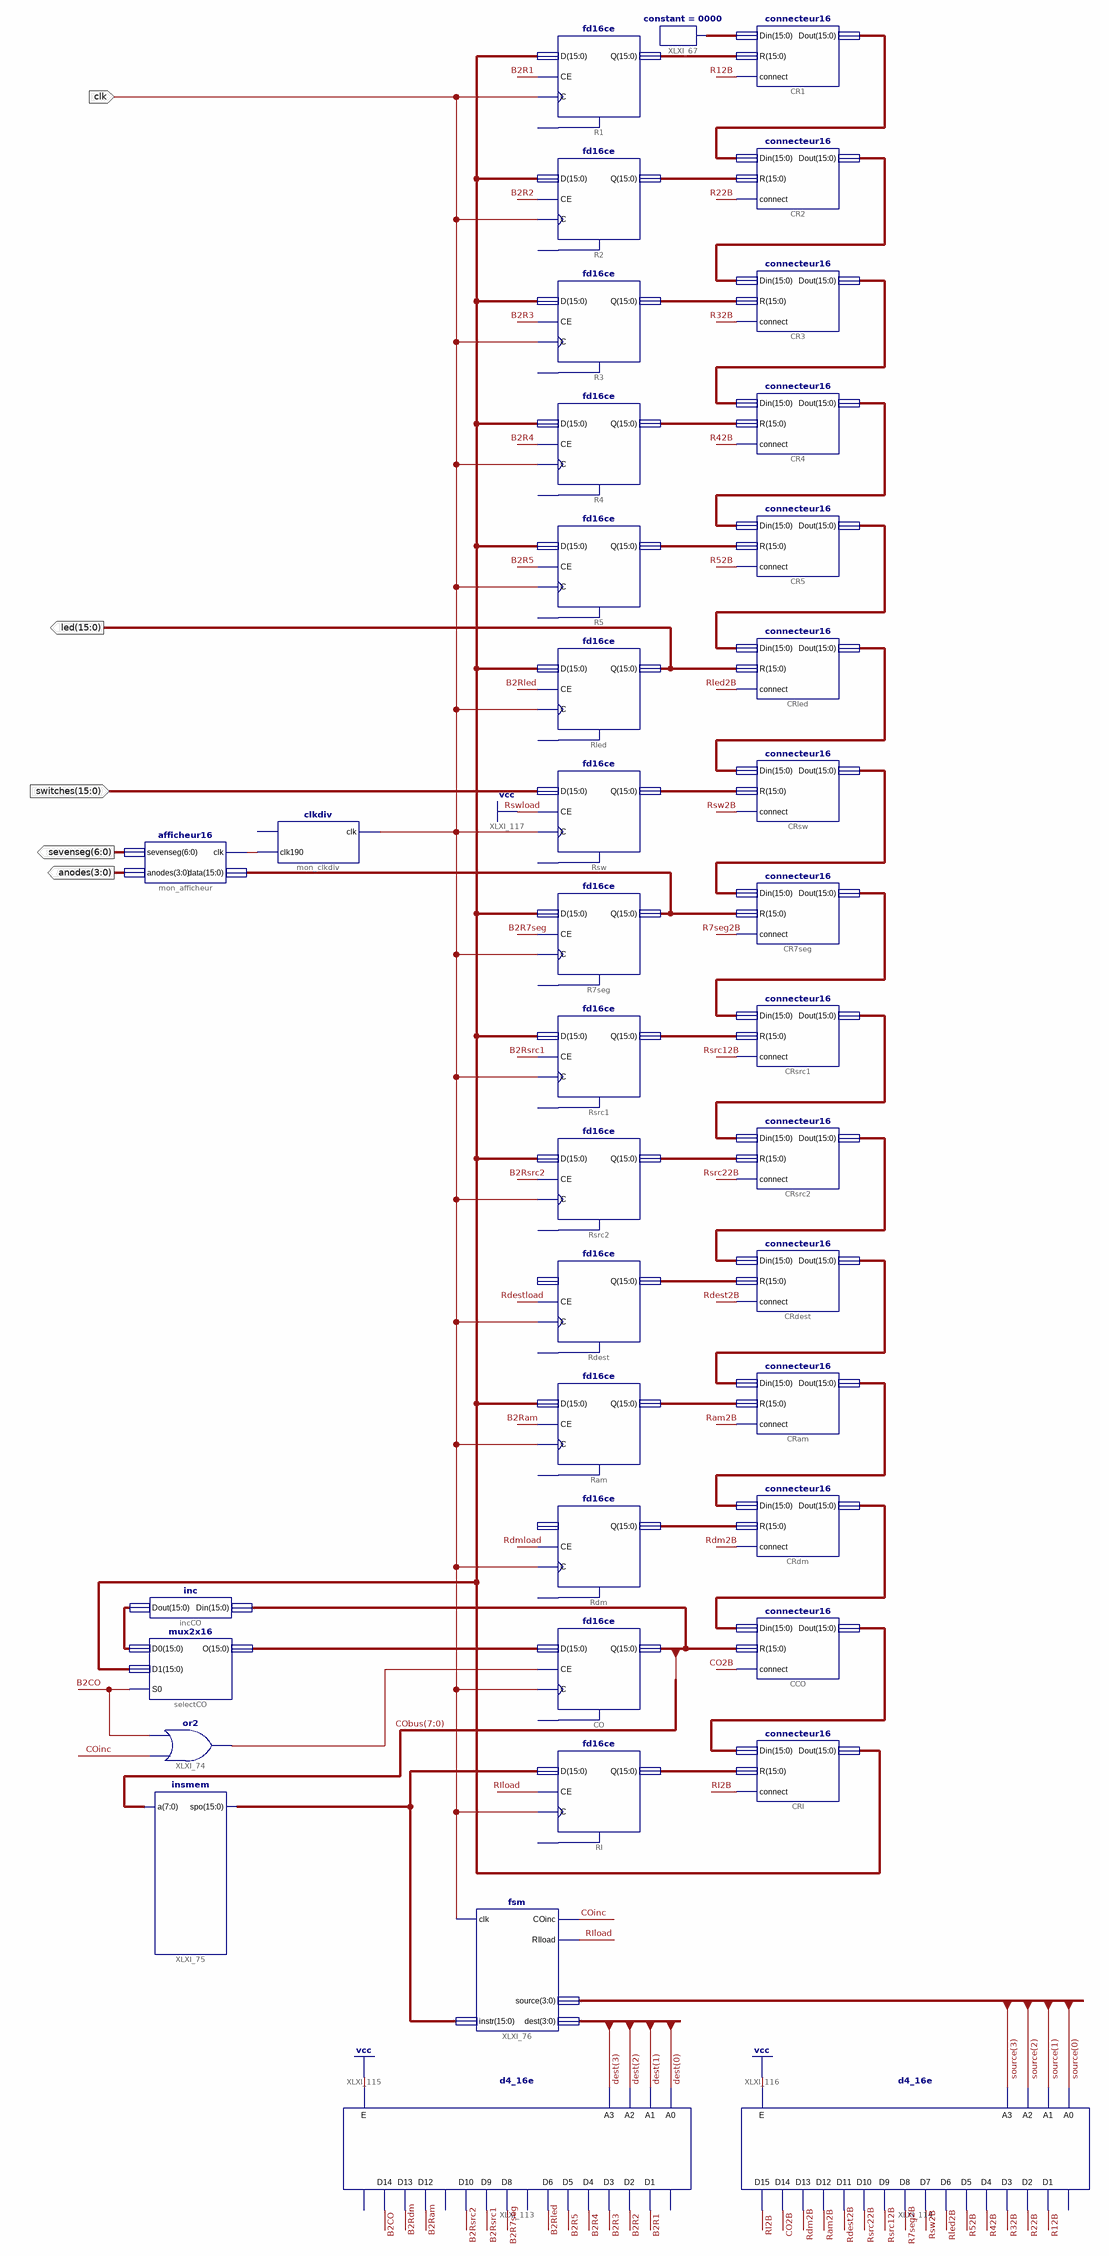
[diagram p0: schematic sheet 1]
// Xilinx ISE schematic S3.sch (spartan3e) as structural Verilog: 40 symbols, 5 ports
module S3 (
  input  [15:0] switches,
  input  clk,
  output [15:0] led,
  output [6:0] sevenseg,
  output [3:0] anodes
);

  wire B2CO, B2R1, B2R2, B2R3, B2R4, B2R5, B2R7seg, B2Ram, B2Rdm, B2Rled, B2Rsrc1, B2Rsrc2, CO2B, COinc,
       R7seg2B, R12B, R22B, R32B, R42B, R52B, Ram2B, Rdest2B, Rdestload, Rdm2B, Rdmload, RI2B, RIload,
       Rled2B, Rsrc12B, Rsrc22B, Rsw2B, XLXN_74, XLXN_93;
  wire [3:0] dest, source;
  wire [15:0] bus_data, CObus, XLXN_4, XLXN_5, XLXN_6, XLXN_7, XLXN_8, XLXN_10, XLXN_11, XLXN_12, XLXN_13,
       XLXN_14, XLXN_15, XLXN_16, XLXN_18, XLXN_19, XLXN_20, XLXN_21, XLXN_22, XLXN_23, XLXN_24, XLXN_25,
       XLXN_26, XLXN_27, XLXN_28, XLXN_29, XLXN_30, XLXN_31, XLXN_32, XLXN_48, XLXN_84, XLXN_86, XLXN_183;

  fd16ce R1 (.C(clk), .CE(B2R1), .D(bus_data), .Q(XLXN_4));  // open: CLR
  fd16ce R2 (.C(clk), .CE(B2R2), .D(bus_data), .Q(XLXN_5));  // open: CLR
  fd16ce R3 (.C(clk), .CE(B2R3), .D(bus_data), .Q(XLXN_6));  // open: CLR
  fd16ce R4 (.C(clk), .CE(B2R4), .D(bus_data), .Q(XLXN_7));  // open: CLR
  fd16ce R5 (.C(clk), .CE(B2R5), .D(bus_data), .Q(XLXN_8));  // open: CLR
  fd16ce Rled (.C(clk), .CE(B2Rled), .D(bus_data), .Q(led));  // open: CLR
  fd16ce Rsw (.C(clk), .CE(1'b1), .D(switches), .Q(XLXN_10));  // open: CLR
  fd16ce R7seg (.C(clk), .CE(B2R7seg), .D(bus_data), .Q(XLXN_11));  // open: CLR
  fd16ce Rsrc1 (.C(clk), .CE(B2Rsrc1), .D(bus_data), .Q(XLXN_12));  // open: CLR
  fd16ce Rsrc2 (.C(clk), .CE(B2Rsrc2), .D(bus_data), .Q(XLXN_13));  // open: CLR
  fd16ce Rdest (.C(clk), .CE(Rdestload), .Q(XLXN_14));  // open: CLR, D
  fd16ce Ram (.C(clk), .CE(B2Ram), .D(bus_data), .Q(XLXN_15));  // open: CLR
  fd16ce Rdm (.C(clk), .CE(Rdmload), .Q(XLXN_16));  // open: CLR, D
  fd16ce CO (.C(clk), .CE(XLXN_93), .D(XLXN_86), .Q(CObus));  // open: CLR
  fd16ce RI (.C(clk), .CE(RIload), .D(XLXN_183), .Q(XLXN_18));  // open: CLR
  connecteur16 CR3 (.Din(XLXN_20), .R(XLXN_6), .connect(R32B), .Dout(XLXN_21));
  connecteur16 CR4 (.Din(XLXN_21), .R(XLXN_7), .connect(R42B), .Dout(XLXN_22));
  connecteur16 CR5 (.Din(XLXN_22), .R(XLXN_8), .connect(R52B), .Dout(XLXN_23));
  connecteur16 CRled (.Din(XLXN_23), .R(led), .connect(Rled2B), .Dout(XLXN_24));
  connecteur16 CRsw (.Din(XLXN_24), .R(XLXN_10), .connect(Rsw2B), .Dout(XLXN_25));
  connecteur16 CR7seg (.Din(XLXN_25), .R(XLXN_11), .connect(R7seg2B), .Dout(XLXN_26));
  connecteur16 CRsrc1 (.Din(XLXN_26), .R(XLXN_12), .connect(Rsrc12B), .Dout(XLXN_27));
  connecteur16 CRsrc2 (.Din(XLXN_27), .R(XLXN_13), .connect(Rsrc22B), .Dout(XLXN_28));
  connecteur16 CRdest (.Din(XLXN_28), .R(XLXN_14), .connect(Rdest2B), .Dout(XLXN_29));
  connecteur16 CRam (.Din(XLXN_29), .R(XLXN_15), .connect(Ram2B), .Dout(XLXN_30));
  connecteur16 CRdm (.Din(XLXN_30), .R(XLXN_16), .connect(Rdm2B), .Dout(XLXN_31));
  connecteur16 CCO (.Din(XLXN_31), .R(CObus), .connect(CO2B), .Dout(XLXN_32));
  connecteur16 CRI (.Din(XLXN_32), .R(XLXN_18), .connect(RI2B), .Dout(bus_data));
  constant #(.CValue("0000")) XLXI_67 (.O(XLXN_48));
  afficheur16 mon_afficheur (.clk(XLXN_74), .data(XLXN_11), .sevenseg(sevenseg), .anodes(anodes));
  clkdiv mon_clkdiv (.clk(clk), .clk190(XLXN_74));  // open: clksec
  inc incCO (.Din(CObus), .Dout(XLXN_84));
  or XLXI_74 (XLXN_93, COinc, B2CO);
  insmem XLXI_75 (.a(CObus[7:0]), .spo(XLXN_183));
  fsm XLXI_76 (.clk(clk), .instr(XLXN_183), .COinc(COinc), .RIload(RIload), .source(source), .dest(dest));
  connecteur16 CR1 (.Din(XLXN_48), .R(XLXN_4), .connect(R12B), .Dout(XLXN_19));
  connecteur16 CR2 (.Din(XLXN_19), .R(XLXN_5), .connect(R22B), .Dout(XLXN_20));
  mux2x16 selectCO (.D0(XLXN_84), .D1(bus_data), .S0(B2CO), .O(XLXN_86));
  d4_16e XLXI_113 (
    .A0(dest[0]), .A1(dest[1]), .A2(dest[2]), .A3(dest[3]), .E(1'b1), .D1(B2R1), .D10(B2Rsrc2), .D12(B2Ram),
    .D13(B2Rdm), .D14(B2CO), .D2(B2R2), .D3(B2R3), .D4(B2R4), .D5(B2R5), .D6(B2Rled), .D8(B2R7seg),
    .D9(B2Rsrc1));  // open: D0, D11, D15, D7
  d4_16e XLXI_114 (
    .A0(source[0]), .A1(source[1]), .A2(source[2]), .A3(source[3]), .E(1'b1), .D1(R12B), .D10(Rsrc22B),
    .D11(Rdest2B), .D12(Ram2B), .D13(Rdm2B), .D14(CO2B), .D15(RI2B), .D2(R22B), .D3(R32B), .D4(R42B),
    .D5(R52B), .D6(Rled2B), .D7(Rsw2B), .D8(R7seg2B), .D9(Rsrc12B));  // open: D0
endmodule
